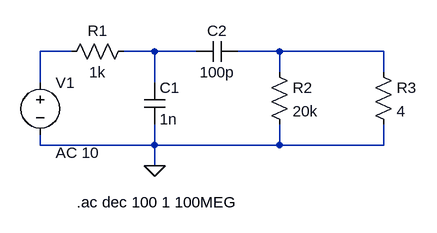
[diagram p0: schematic bandpass-filter-with-loading.asc]
bandpass-filter-with-loading.asc, the LTspice schematic file:
Version 4
SHEET 1 880 680
WIRE 128 112 80 112
WIRE 256 112 208 112
WIRE 320 112 256 112
WIRE 448 112 384 112
WIRE 608 112 448 112
WIRE 448 144 448 112
WIRE 608 144 608 112
WIRE 80 160 80 112
WIRE 256 160 256 112
WIRE 80 256 80 240
WIRE 256 256 256 224
WIRE 256 256 80 256
WIRE 448 256 448 224
WIRE 448 256 256 256
WIRE 608 256 608 224
WIRE 608 256 448 256
WIRE 256 288 256 256
FLAG 256 288 0
SYMBOL res 224 96 R90
WINDOW 0 0 56 VBottom 2
WINDOW 3 32 56 VTop 2
SYMATTR InstName R1
SYMATTR Value 1k
SYMBOL cap 240 160 R0
SYMATTR InstName C1
SYMATTR Value 1n
SYMBOL cap 384 96 R90
WINDOW 0 0 32 VBottom 2
WINDOW 3 32 32 VTop 2
SYMATTR InstName C2
SYMATTR Value 100p
SYMBOL res 432 128 R0
SYMATTR InstName R2
SYMATTR Value 20k
SYMBOL voltage 80 144 R0
WINDOW 123 24 124 Left 2
WINDOW 39 0 0 Left 2
SYMATTR InstName V1
SYMATTR Value ""
SYMATTR Value2 AC 10
SYMBOL res 592 128 R0
SYMATTR InstName R3
SYMATTR Value 4
TEXT 136 344 Left 2 !.ac dec 100 1 100MEG

The netlist it stands for:
* bandpass-filter-with-loading.asc
R1 N002 N001 1k
C1 N002 0 1n
C2 N003 N002 100p
R2 N003 0 20k
V1 N001 0 AC 10
R3 N003 0 4
.ac dec 100 1 100MEG
.backanno
.end